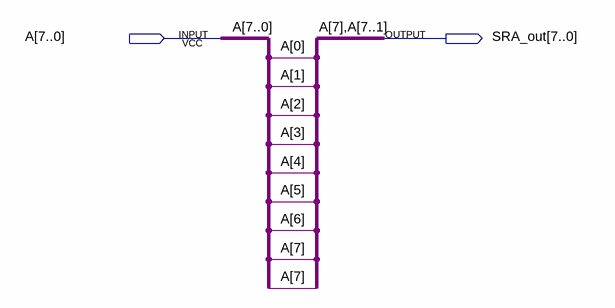
[diagram p0: schematic sheet]
// Quartus schematic shift_right_arithmetic.bdf as structural Verilog: 0 symbols, 2 pins
module shift_right_arithmetic (
  input  [7:0] A,
  output [7:0] SRA_out
);


  assign SRA_out = {{2{A[7]}}, A[6:1]};
endmodule
